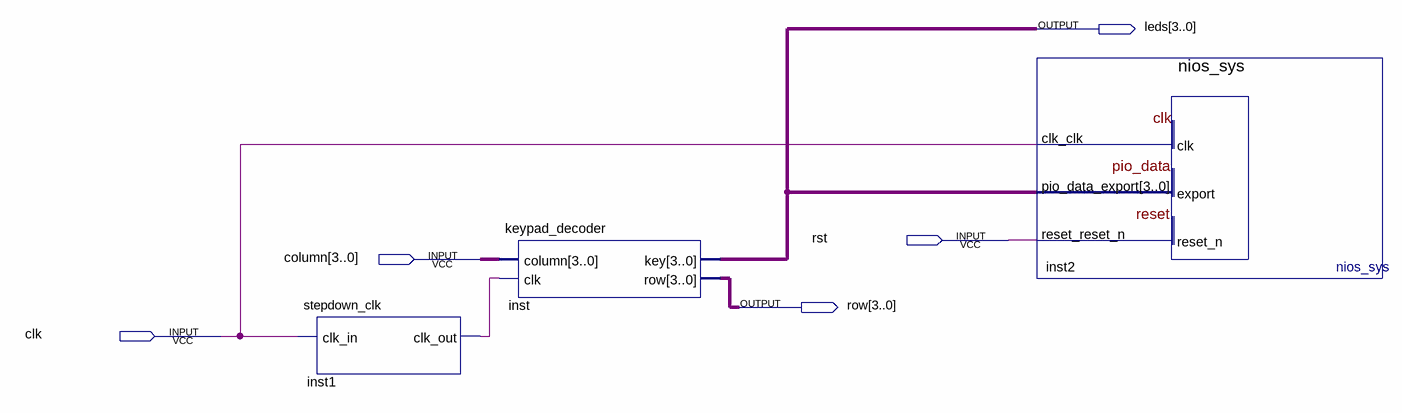
[diagram p0: schematic sheet]
// Quartus schematic keypad_decoder_nios.bdf as structural Verilog: 3 symbols, 5 pins
module keypad_decoder_nios (
  input  rst,
  input  [3:0] column,
  input  clk,
  output [3:0] leds,
  output [3:0] row
);

  wire inst1_clk_out;

  stepdown_clk inst1 (.clk_in(clk), .clk_out(inst1_clk_out));
  keypad_decoder inst (.column(column), .clk(inst1_clk_out), .key(leds), .row(row));
  nios_sys inst2 (.clk_clk(clk), .pio_data_export(leds), .reset_reset_n(rst));
endmodule
